# EAGLE design Lift2 (EAGLE 7.6.0)
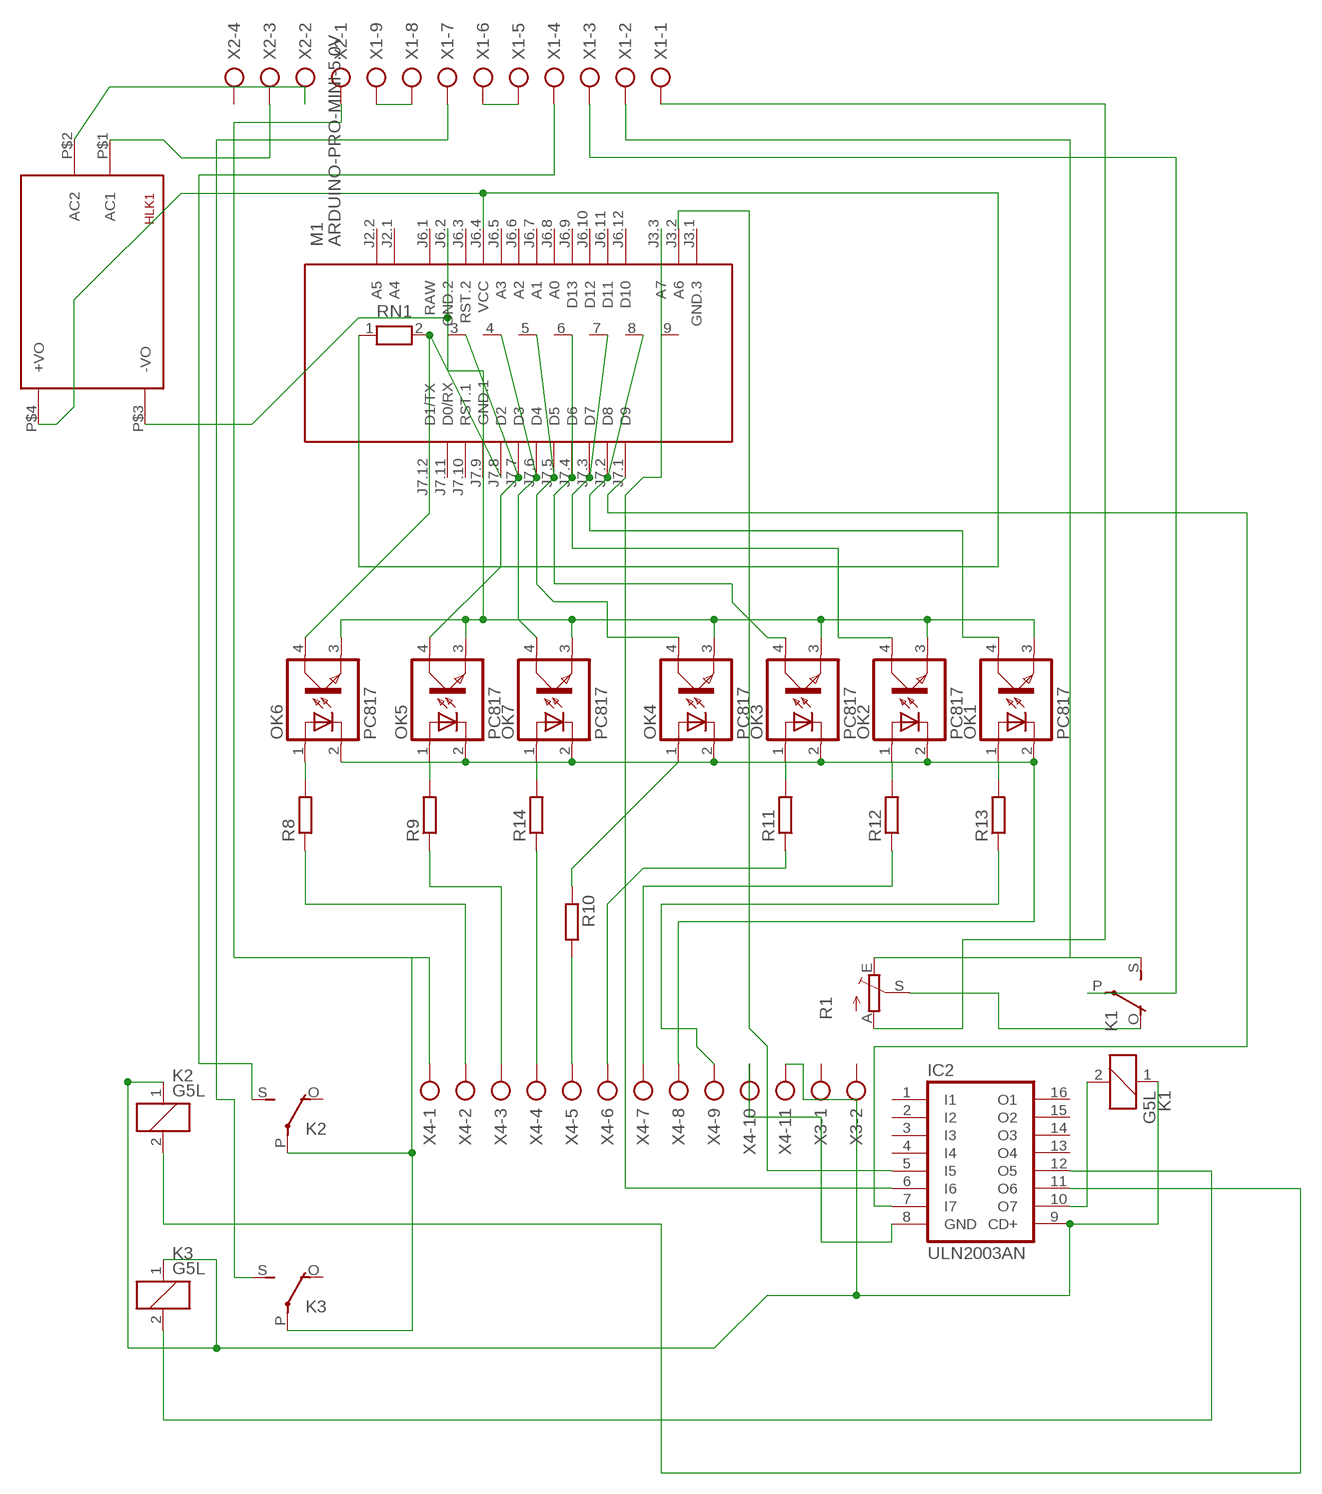
[diagram p0: schematic, sheet 1]

## Parts
HLK1  HLK-PM013W  [HLK-PM01]
IC2  ULN2003AN  [DIL16]
K1  G5L  [G5LE]
K2  G5L  [G5LE]
K3  G5L  [G5LE]
M1  ARDUINO-PRO-MINI-5.0V  [ARDUINO-PRO-MINI]
OK1  PC817  [DIL04]
OK2  PC817  [DIL04]
OK3  PC817  [DIL04]
OK4  PC817  [DIL04]
OK5  PC817  [DIL04]
OK6  PC817  [DIL04]
OK7  PC817  [DIL04]
R1  TRIM_EU-CA6V  [CA6V]
R8  R-EU_0204/7  [0204/7]
R9  R-EU_0204/7  [0204/7]
R10  R-EU_0204/7  [0204/7]
R11  R-EU_0204/7  [0204/7]
R12  R-EU_0204/7  [0204/7]
R13  R-EU_0204/7  [0204/7]
R14  R-EU_0204/7  [0204/7]
RN1  RN08  [RN-9]
X1  AK300/9  [AK300/9]
X2  AK300/4  [AK300/4]
X3  AK300/2  [AK300/2]
X4  AK300/11  [AK300/11]

## Nets
5V: HLK1.P$4(+VO) M1.J6.4(VCC) RN1.1
12V: IC2.9(CD+) K1.1 K2.1 K3.1 X4.11
24V: K2.P(2:P) K3.P(2:P) X2.1 X4.1
GND1: HLK1.P$3(-VO) M1.J6.2(GND.2) M1.J7.9(GND.1) OK1.3(EMIT) OK2.3(EMIT) OK3.3(EMIT) OK4.3(EMIT) OK5.3(EMIT) OK6.3(EMIT) OK7.3(EMIT)
GND2: OK1.2(C) OK2.2(C) OK3.2(C) OK4.2(C) OK5.2(C) OK6.2(C) OK7.2(C) X4.8
GND3: IC2.8(GND) X4.10
L: HLK1.P$1(AC1) X2.3
N: HLK1.P$2(AC2) X2.2
N$1: OK2.1(A) R12.2
N$2: OK1.1(A) R13.2
N$3: OK3.1(A) R11.2
N$4: R10.2 X4.5
N$5: OK7.1(A) R14.2
N$6: R14.1 X4.4
N$7: IC2.10(O7) K1.2
N$8: M1.J7.7(D3) OK5.4(COL) RN1.3
N$9: M1.J7.5(D5) OK4.4(COL) RN1.5
N$10: M1.J7.4(D6) OK3.4(COL) RN1.6
N$11: K1.O(2:O) R1.S
N$12: M1.J7.6(D4) OK7.4(COL) RN1.4
N$13: K1.S(2:S) R1.E X1.2
N$14: K1.P(2:P) X1.3
N$15: R8.1 X4.2
N$16: R9.1 X4.3
N$17: R11.1 X4.6
N$18: M1.J7.3(D7) OK2.4(COL) RN1.7
N$19: OK5.1(A) R9.2
N$20: R13.1 X4.9
N$21: X1.5 X1.6
N$22: IC2.12(O5) K3.2
N$23: R12.1 X4.7
N$24: M1.J7.2(D8) OK1.4(COL) RN1.8
N$25: IC2.7(I7) M1.J7.1(D9)
N$26: IC2.11(O6) K2.2
N$28: K3.S(2:S) X1.7
N$29: R1.A X1.1
N$30: K2.S(2:S) X1.4
N$32: M1.J7.8(D2) OK6.4(COL) RN1.2
N$33: OK6.1(A) R8.2
N$34: OK4.1(A) R10.1
N$35: IC2.5(I5) M1.J3.2(A6)
N$36: IC2.6(I6) M1.J3.3(A7)
N$40: X1.8 X1.9
Unconnected: IC2.1(I1) IC2.2(I2) IC2.3(I3) IC2.4(I4) IC2.13(O4) IC2.14(O3) IC2.15(O2) IC2.16(O1) K2.O(2:O) K3.O(2:O) M1.J2.1(A4) M1.J2.2(A5) M1.J3.1(GND.3) M1.J6.3(RST.2) M1.J6.5(A3) M1.J6.6(A2) M1.J6.7(A1) M1.J6.8(A0) M1.J6.9(D13) M1.J6.10(D12) M1.J6.11(D11) M1.J6.12(D10) M1.J7.10(RST.1) M1.J7.11(D0/RX) M1.J7.12(D1/TX) RN1.9 X2.4 X3.1 X3.2

## Power pins joined to a net without a drawn wire
RAW: M1.J6.1(RAW)

## Library data of the parts
HLK1 = HLK-PM01:HLK-PM01: Hi-Link Power Supply HLK-PM01 3W Author: Ahmed Said <https://github.com/AhmedSaid/EAGLELibraries>
IC2 = uln-udn:ULN2003A: DRIVER ARRAY
K1-K3 = relay:G5L: RELAY 1 x switch, 10 A/120 V AC, 8 A/30 V ADC, Omron; OC_FARNELL: unknown; OC_NEWARK: unknown
M1 = diy-modules:ARDUINO-PRO-MINI-*: Arduino Pro Mini and compatible devices More details available here: https://www.arduino.cc/en/Main/ArduinoBoardProMini Click here to find device on ebay.com <http://www.ebay.com/sch/arduino+pro+mini>
OK1-OK7 = optocoupler:PC817: SHARP OPTO COUPLER; MPN: PC817X4J000F; OC_FARNELL: 9707727; OC_NEWARK: 97K7059
R1 = pot:TRIM_EU-: POTENTIOMETER
R8-R14 = rcl:R-EU_: RESISTOR, European symbol
RN1 = resistor-net:RN08: RESISTOR NETWORK; OC_FARNELL: unknown; OC_NEWARK: unknown
X1 = con-ptr500:AK300/9: CONNECTOR; OC_FARNELL: unknown; OC_NEWARK: unknown
X2 = con-ptr500:AK300/4: CONNECTOR; OC_FARNELL: unknown; OC_NEWARK: unknown
X3 = con-ptr500:AK300/2: CONNECTOR; OC_FARNELL: unknown; OC_NEWARK: unknown
X4 = con-ptr500:AK300/11: CONNECTOR; OC_FARNELL: unknown; OC_NEWARK: unknown

## Board
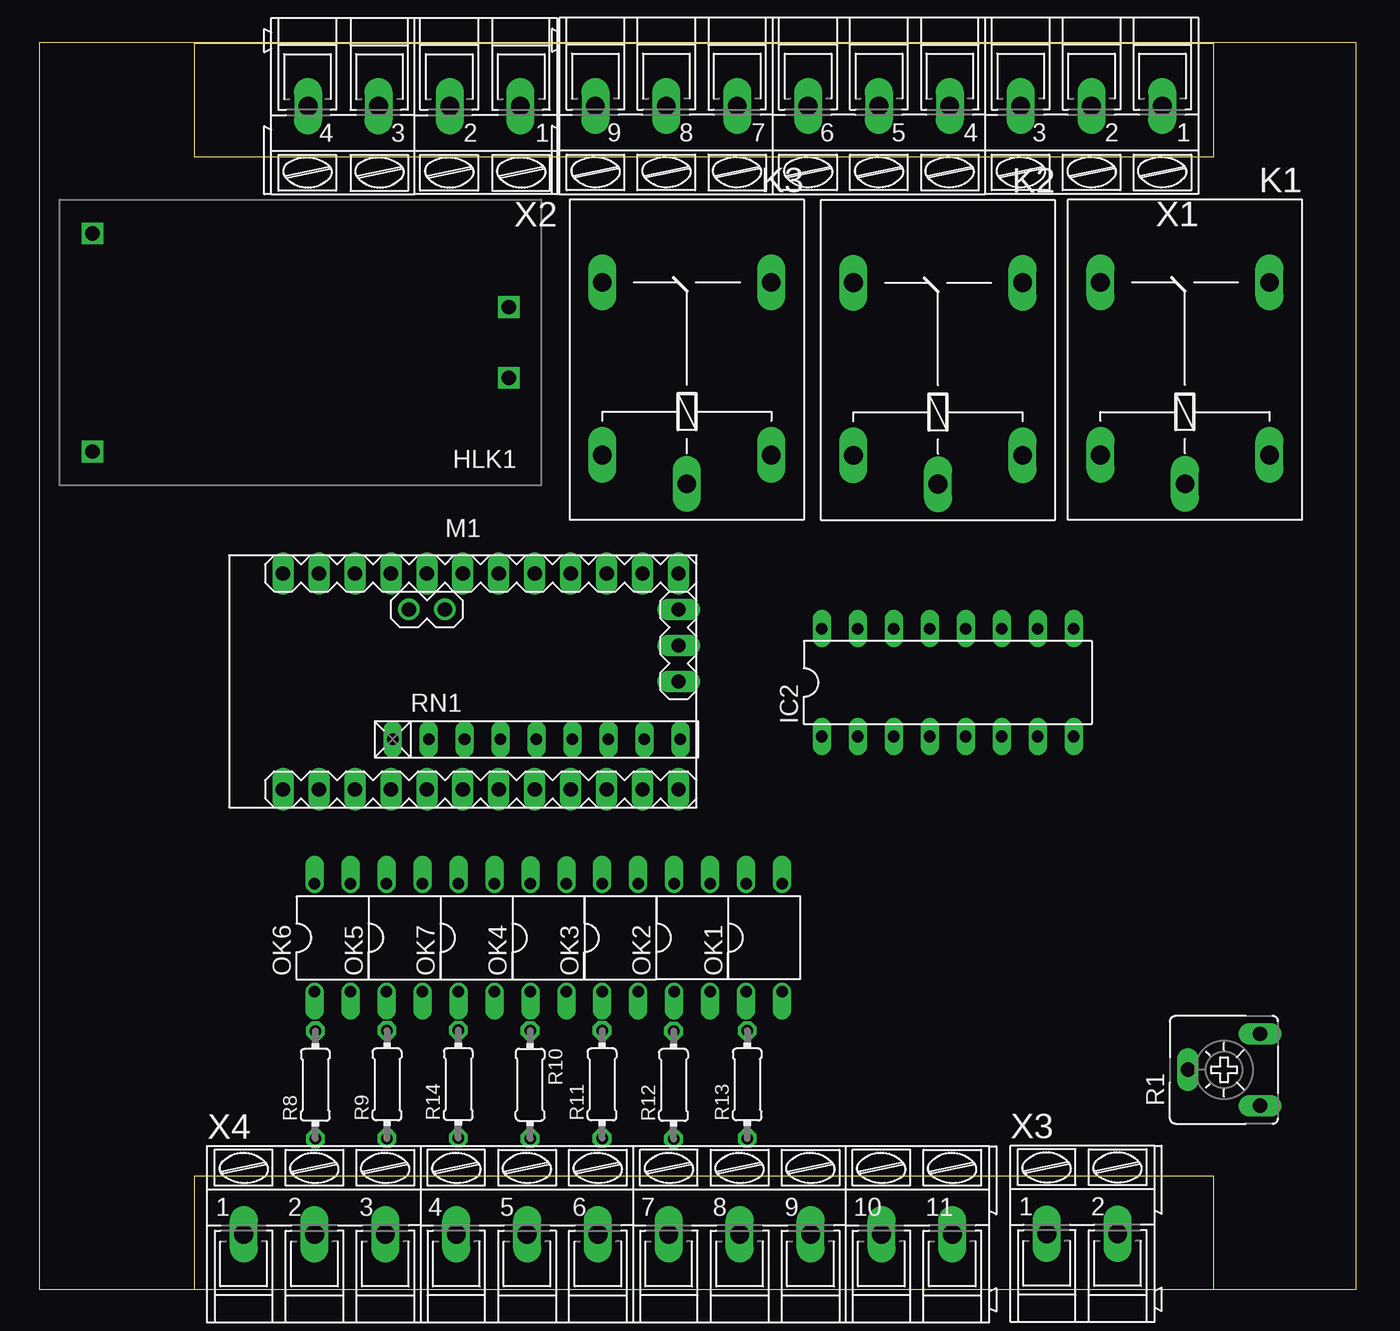
[diagram p1: board, top side]
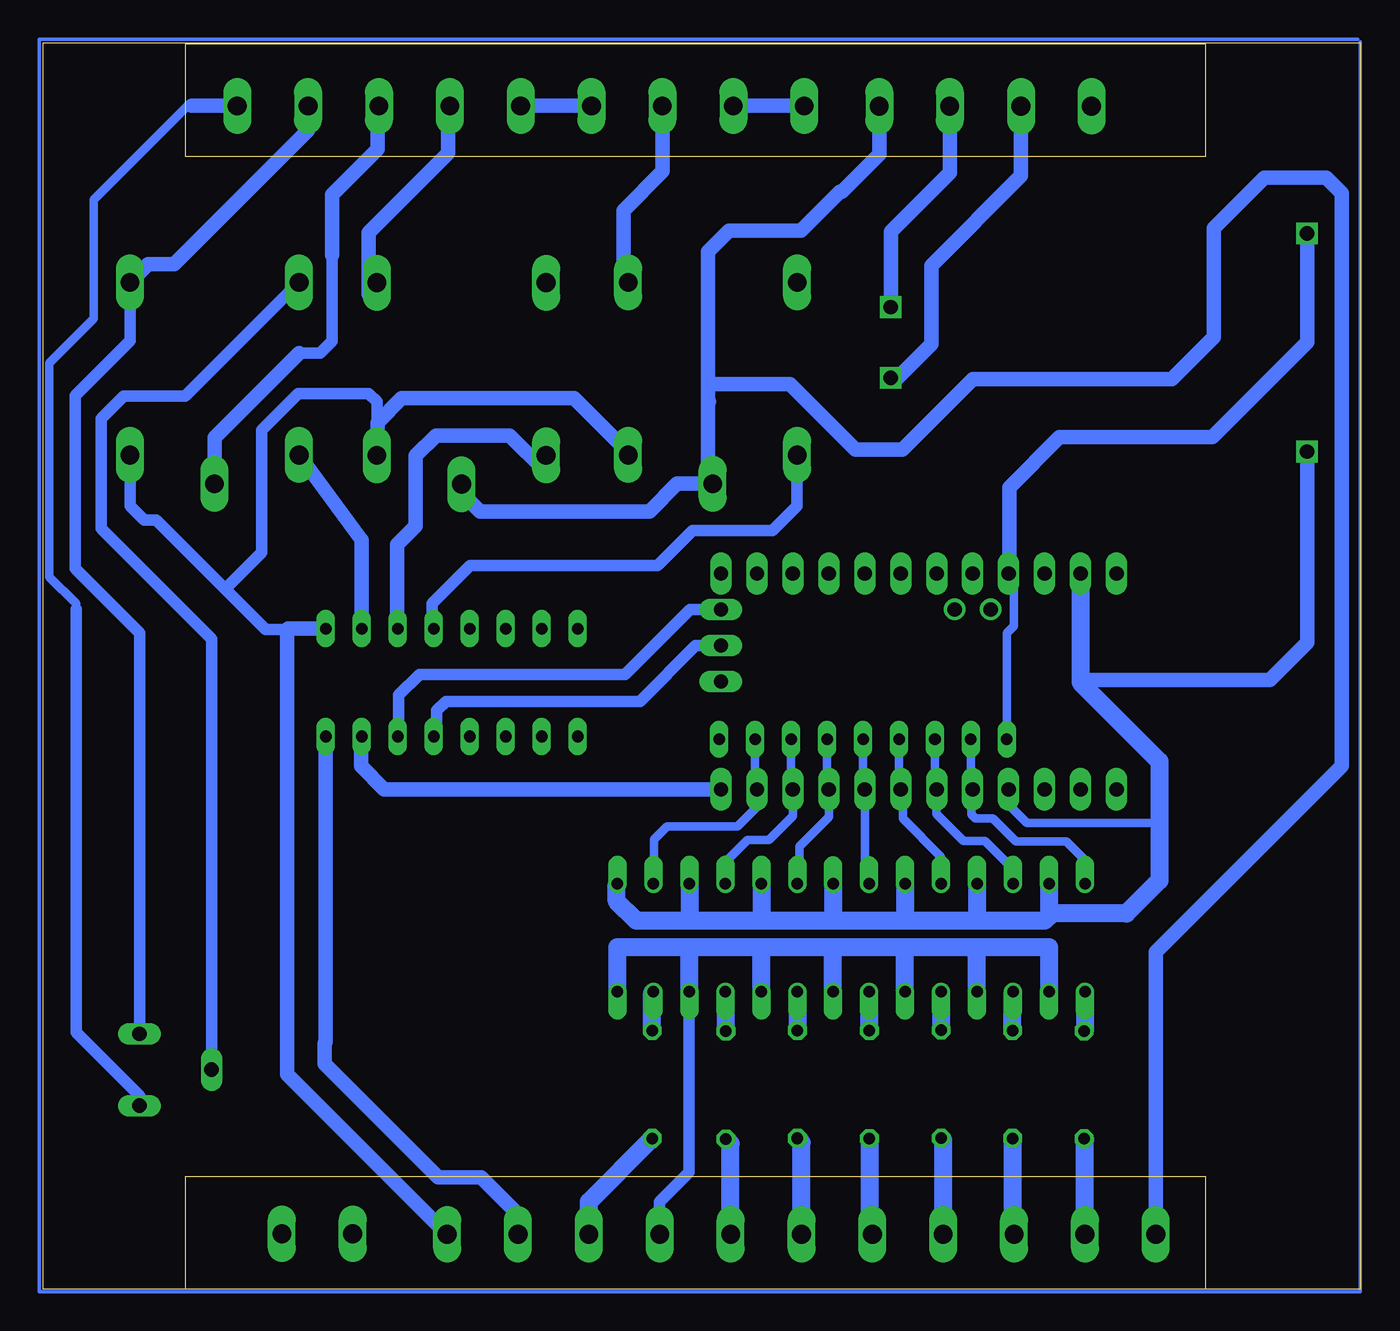
[diagram p2: board, bottom side, seen from below]

Size 93 x 88.03 mm. Coordinates in mm from the lower left corner, seen from the top.
Outline: 0,0.03 93,0.03 93,88.03 0,88.03 0,0.03
Copper layers (1*16): Top 0.035mm / dielectric 1.5mm / Bottom 0.035mm
Design rules "default": minimum track width 10mil, minimum drill 24mil, track to track 8mil, track to pad 8mil, pad to pad 8mil, via to via 8mil, smd to smd 8mil, copper to edge 40mil, drill to drill 8mil, minimum pad ring 10mil, minimum via ring 8mil, stop-mask expansion 4mil, vias tented up to drill 0mil, thermal gap 10mil

### Footprints (pad centres in the part's own frame; a part is rotated, then mirrored left to right if it is on the bottom)
HLK-PM01 = drill 1.016 square: P$1 -14.7,2.5; P$2 -14.7,-2.5; P$3 14.7,7.7; P$4 14.7,-7.7
DIL16 = drill 0.813 long: 1 -8.89,-3.81; 2 -6.35,-3.81; 3 -3.81,-3.81; 4 -1.27,-3.81; 5 1.27,-3.81; 6 3.81,-3.81; 7 6.35,-3.81; 8 8.89,-3.81; 9 8.89,3.81; 10 6.35,3.81; 11 3.81,3.81; 12 1.27,3.81; 13 -1.27,3.81; 14 -3.81,3.81; 15 -6.35,3.81; 16 -8.89,3.81
G5LE = drill 1.321 long: 1 -7.493,-5.969; 2 -7.493,5.969; O 4.699,5.969; P -9.525,0; S 4.699,-5.969
ARDUINO-PRO-MINI = drill 1: J2.1 -1.27,5.08; J2.2 -3.81,5.08 | drill 1 long: J3.1 15.24,0; J3.2 15.24,2.54; J3.3 15.24,5.08; J6.1 -12.7,7.62; J6.2 -10.16,7.62; J6.3 -7.62,7.62; J6.4 -5.08,7.62; J6.5 -2.54,7.62; J6.6 0,7.62; J6.7 2.54,7.62; J6.8 5.08,7.62; J6.9 7.62,7.62; J6.10 10.16,7.62; J6.11 12.7,7.62; J6.12 15.24,7.62; J7.1 15.24,-7.62; J7.2 12.7,-7.62; J7.3 10.16,-7.62; J7.4 7.62,-7.62; J7.5 5.08,-7.62; J7.6 2.54,-7.62; J7.7 0,-7.62; J7.8 -2.54,-7.62; J7.9 -5.08,-7.62; J7.10 -7.62,-7.62; J7.11 -10.16,-7.62; J7.12 -12.7,-7.62
DIL04 = drill 0.813 offset: 1 -1.27,-3.81; 2 1.27,-3.81; 3 1.27,3.81; 4 -1.27,3.81
CA6V = drill 1.016 long: A -2.54,-2.54; E 2.54,-2.54; S 0,2.54
0204/7 = drill 0.813 octagon: 1 -3.81,0; 2 3.81,0
RN-9 = drill 0.813 long: 1 -10.16,0; 2 -7.62,0; 3 -5.08,0; 4 -2.54,0; 5 0,0; 6 2.54,0; 7 5.08,0; 8 7.62,0; 9 10.16,0
AK300/9 = drill 1.321 long: 1 -20.015,0; 2 -15.011,0; 3 -10.008,0; 4 -5.004,0; 5 0,0; 6 5.004,0; 7 10.008,0; 8 15.011,0; 9 20.015,0
AK300/4 = drill 1.321 long: 1 -7.493,0; 2 -2.515,0; 3 2.515,0; 4 7.493,0
AK300/2 = drill 1.321 long: 1 -2.515,0; 2 2.489,0
AK300/11 = drill 1.321 long: 1 -25.019,0; 2 -20.015,0; 3 -15.011,0; 4 -10.008,0; 5 -5.004,0; 6 0,0; 7 5.004,0; 8 10.008,0; 9 15.011,0; 10 20.015,0; 11 25.019,0

### Placement (x,y rotation side)
HLK1  18.44,66.87 180 top
IC2  64.15,42.86 0 top
K1  80.9,66.42 90 top
K2  63.46,66.39 90 top
K3  45.72,66.42 90 top
M1  29.91,42.94 0 top
OK1  51.19,24.84 0 top
OK2  46.11,24.84 0 top
OK3  41.02,24.83 0 top
OK4  35.95,24.83 0 top
OK5  25.79,24.83 0 top
OK6  20.71,24.83 0 top
OK7  30.87,24.83 0 top
R1  83.66,15.51 90 top
R8  19.49,14.45 90 top
R9  24.55,14.48 90 top
R10  34.66,14.46 270 top
R11  39.74,14.48 90 top
R12  44.79,14.44 90 top
R13  49.99,14.48 90 top
R14  29.58,14.5 90 top
RN1  35.11,38.85 0 top
X1  59.28,83.58 180 top
X2  26.47,83.56 180 top
X3  73.66,3.93 0 top
X4  39.45,3.9 0 top

### Tracks (layer width: path | path; a pad name or v marks a point on that pad's centre or on a via)
5V
  Bottom 0.61: RN1.1 24.95,46.36 24.47,46.84 24.47,50.2 M1.J6.4
  Bottom 1.016: HLK1.P$4 3.74,66.9 10.44,60.2 21.23,60.2 24.79,56.64 24.79,50.6 M1.J6.4
12V
  Bottom 0.813: 75.78,46.6 77.3,46.6 80.15,49.45 | 80.15,49.45 85.02,54.32 85.88,54.32 86.87,55.31 K1.1 | K2.1 69.43,62.69 70,63.27 74.99,63.27 77.56,60.7 77.56,52.04 80.15,49.45
  Bottom 1.016: X4.11 75.78,15.2 75.78,46.6 75.71,46.67 IC2.9 | K3.1 52.02,59.45 55.5,62.93 67.68,62.93 69.38,61.22 69.38,58.94 K2.1
24V
  Bottom 1.016: 46.05,62.77 46.05,57.22 K3.P 48.23,56.89 50.18,54.95 62.16,54.95 63.46,56.24 K2.P | 46.05,62.77 46.05,64.05 | 46.05,64.05 46.05,66.87 | 46.05,66.87 46.05,67.58 | 45.98,62.7 46.05,62.77 | X4.1 14.43,23.82 1.3,36.96 1.3,77.4 2.4,78.5 6.77,78.5 10.33,74.95 10.33,67.24 13.29,64.28 27.36,64.28 32.34,59.3 35.65,59.3 40.27,63.93 45.93,63.93 46.05,64.05 | X2.1 33.96,80.16 36.59,77.53 36.74,77.53 39.5,74.78 44.57,74.78 46.06,73.29 46.06,66.89 46.05,66.87
GND1
  Bottom 0.61: M1.J7.9 24.83,34.25 23.52,32.94 14.37,32.94 14.17,33.14
  Bottom 1.016: HLK1.P$3 3.74,45.68 6.37,43.05 19.34,43.05 19.75,43.46
  Bottom 1.27: OK6.3 21.98,26.34 | 21.98,26.34 22.29,26.03 26.85,26.03 | 26.85,26.03 32.04,26.03 | 32.04,26.03 37.31,26.03 | 37.31,26.03 42.3,26.03 | 42.3,26.03 47.41,26.03 | 47.41,26.03 51.12,26.03 52.5,27.42 52.5,28.6 OK1.3 | OK2.3 47.38,26.07 47.41,26.03 | OK3.3 42.29,26.04 42.3,26.03 | OK4.3 37.21,26.13 37.31,26.03 | OK7.3 32.14,26.13 32.04,26.03 | OK5.3 27.06,26.25 26.85,26.03 | M1.J6.2 19.75,43.46 19.75,42.87 14.17,37.3 14.17,33.14 14.17,28.87 16.5,26.54 21.78,26.54 21.98,26.34
GND2
  Bottom 0.813: OK2.2 47.46,20.95 47.46,20.37 47.4,20.31 47.4,8.27 49.46,6.21 X4.8
  Bottom 1.27: OK1.2 52.46,24.18 47.38,24.18 | 47.38,24.18 42.29,24.18 | 42.29,24.18 37.01,24.18 | 37.01,24.18 32.45,24.18 | 32.45,24.18 27.51,24.18 | 27.51,24.18 21.98,24.18 OK6.2 | 27.51,24.18 27.06,23.73 OK5.2 | OK7.2 32.14,23.86 32.45,24.18 | OK4.2 37.21,23.98 37.01,24.18 | OK3.2 42.29,24.18 | OK2.2 47.38,24.18
GND3
  Bottom 1.016: IC2.8 73.04,17.47 73.14,17.36 73.14,15.93 65.12,7.91 62.08,7.91 59.47,5.3 X4.10
L
  Bottom 1.016: HLK1.P$1 32.66,64.37 30.29,66.74 30.29,72.31 23.96,78.64 X2.3
N
  Bottom 1.016: 33.14,70.28 HLK1.P$2 33.14,74.7 28.99,78.86 X2.2
N$1
  Bottom 1.27: R12.2 44.79,20.98 OK2.1
N$2
  Bottom 1.27: R13.2 49.99,20.95 OK1.1
N$3
  Bottom 1.27: OK3.1 R11.2
N$4
  Bottom 1.27: R10.2 34.66,4.11 X4.5
N$5
  Bottom 1.27: OK7.1 29.6,18.32 R14.2
N$6
  Bottom 1.27: X4.4 29.44,10.55 R14.1
N$7
  Bottom 1.016: IC2.10 70.5,52.93 K1.2
N$8
  Bottom 0.61: OK5.4 24.52,29.7 26.5,31.67 28.03,31.67 29.93,33.57 29.93,35.29 M1.J7.7 30.03,35.44 RN1.3
N$9
  Bottom 0.61: OK4.4 34.99,28.95 M1.J7.5 35.11,35.44 RN1.5
N$10
  Bottom 0.61: OK3.4 39.6,28.79 39.6,31.28 37.53,33.35 M1.J7.4 37.65,35.44 RN1.6
N$11
  Bottom 0.813: R1.S 81.12,45.95 88.88,53.71 88.88,61.5 87.31,63.07 82.98,63.07 K1.O
N$12
  Bottom 0.61: OK7.4 29.6,30.55 32.31,33.26 32.31,34.8 | 32.31,34.8 32.31,35.18 M1.J7.6 | RN1.4 32.57,35.07 32.31,34.8
N$13
  Bottom 0.813: R1.E 86.2,46.37 90.75,50.92 90.75,63.12 86.87,67 K1.S
  Bottom 1.016: 86.31,17.94 R1.E 86.25,18 | X1.2 74.29,81.86 83.75,72.4 85.59,72.4 K1.S
N$14
  Bottom 0.813: 74.94,66.13 73.45,66.13 72.6,66.98 72.6,73.03
  Bottom 1.016: K1.P 80.9,60.17 74.94,66.13 | 72.6,73.03 72.6,77.32 69.4,80.52 69.4,83.47 X1.3
N$15
  Bottom 1.27: X4.2 19.44,10.58 R8.1
N$16
  Bottom 1.27: R9.1 24.55,4.65 24.46,4.56 24.46,3.92 X4.3
N$17
  Bottom 1.27: X4.6 39.45,10.39 R11.1
N$18
  Bottom 0.61: OK2.4 44.87,28.68 44.87,30.13 43.25,31.75 41.74,31.75 40.07,33.43 M1.J7.3 40.19,35.44 RN1.7
N$19
  Bottom 1.27: R9.2 24.55,20.99 OK5.1
N$20
  Bottom 1.27: X4.9 54.46,6.2 R13.1
N$21
  Bottom 1.016: X1.6 X1.5
N$22
  Bottom 0.813: K3.2 39.76,55.33 41.51,53.58 47.15,53.58 49.61,51.12 62.85,51.12 65.53,48.44 65.53,46.78 IC2.12
N$23
  Bottom 1.27: X4.7 44.45,10.3 R12.1
N$24
  Bottom 0.61: OK1.4 49.86,28.7 49.86,31.79 48.95,32.7 43.96,32.7 42.61,34.06 M1.J7.2 42.73,35.44 RN1.8
N$25
  Bottom 1.016: M1.J7.1 68.92,35.32 70.55,36.96 70.55,38.99 IC2.7
N$26
  Bottom 1.016: K2.2 57.57,57.81 60.07,60.31 65.27,60.31 66.69,58.88 66.69,53.92 68,52.61 68,46.72 IC2.11
N$28
  Bottom 1.016: K3.S 52.02,72.69 52.02,76.2 49.25,78.96 49.25,83.55 X1.7
N$29
  Bottom 0.61: 90.67,48.04 90.67,48.42 92.57,50.32 92.57,65.42 89.45,68.54 89.45,76.94 82.81,83.58 82.52,83.58
  Bottom 0.813: R1.A 86.2,13.69 90.67,18.17 90.67,48.04
  Bottom 1.016: X1.1 82.52,83.58
N$30
  Bottom 1.016: 69.29,69.99 K2.S 70.03,70.3 70.03,74.61 64.4,80.25 64.4,83.47 X1.4
N$32
  Bottom 0.61: OK6.4 19.44,30.32 20.75,31.63 24.31,31.63 25.94,33.26 27.17,33.26 27.44,33.53 27.44,35.24 M1.J7.8 27.49,35.44 RN1.2
N$33
  Bottom 1.27: OK6.1 19.44,18.31 R8.2
N$34
  Bottom 1.27: R10.1 34.66,21 OK4.1
N$35
  Bottom 0.813: M1.J3.2 46.92,45.48 50.86,41.54 64.56,41.54 65.22,40.87 65.22,39.24 IC2.5
N$36
  Bottom 0.813: M1.J3.3 47.33,48.02 51.91,43.44 66.41,43.44 67.89,41.96 67.89,39.12 IC2.6
N$40
  Bottom 1.016: X1.9 X1.8
S$1
  Bottom 0.254: -0.02,88.11 -0.02,-0.17 93.29,-0.17 93.29,88.3 0.17,88.3